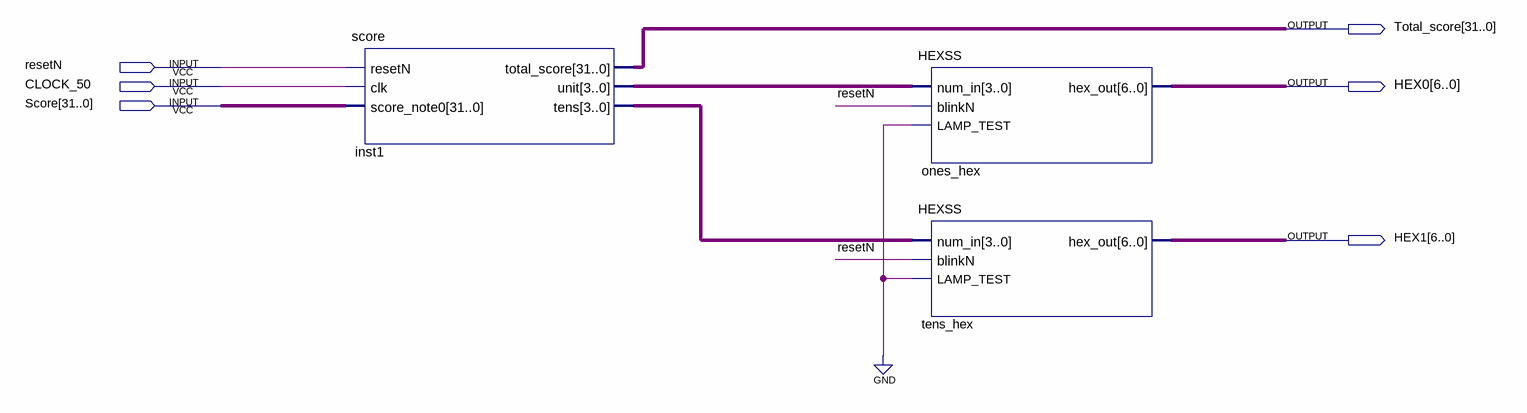
[diagram p0: schematic sheet]
// Quartus schematic score_module_diag.bdf as structural Verilog: 3 symbols, 6 pins
module score_module_diag (
  input  resetN,
  input  CLOCK_50,
  input  [31:0] Score,
  output [31:0] Total_score,
  output [6:0] HEX0,
  output [6:0] HEX1
);

  wire [3:0] inst1_tens, inst1_unit;

  score inst1 (
    .resetN(resetN), .clk(CLOCK_50), .score_note0(Score), .total_score(Total_score), .unit(inst1_unit),
    .tens(inst1_tens));
  HEXSS ones_hex (.num_in(inst1_unit), .blinkN(resetN), .LAMP_TEST(1'b0), .hex_out(HEX0));
  HEXSS tens_hex (.num_in(inst1_tens), .blinkN(resetN), .LAMP_TEST(1'b0), .hex_out(HEX1));
endmodule
